# EAGLE design pdp (EAGLE 7.7.0)
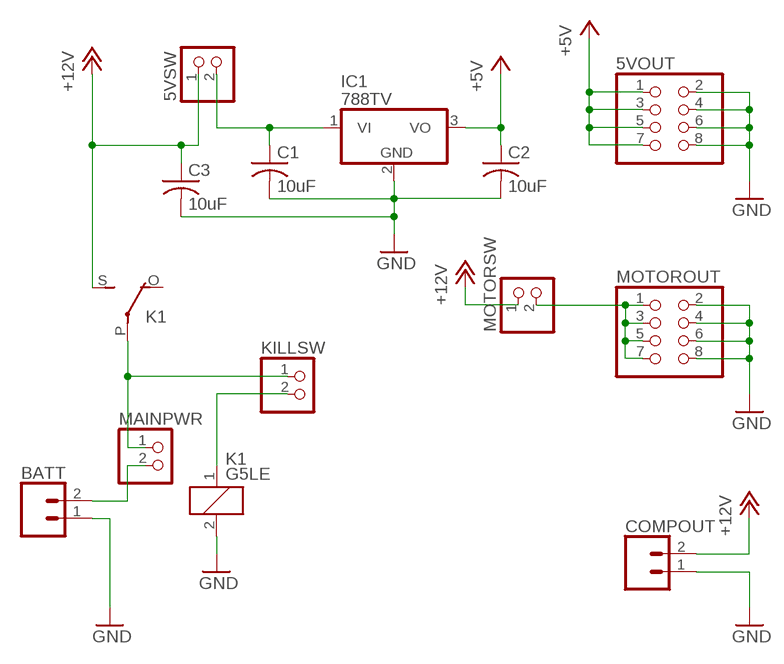
[diagram p0: schematic, sheet 1]

## Parts
5VOUT  PINHD-2X4  [2X04]
5VSW  PINHD-1X2  [1X02]
BATT  CONN_025MM  [SCREWTERMINAL-5MM-2]
C1  10uF  C-USC0805  [C0805]
C2  10uF  C-USC0805  [C0805]
C3  10uF  C-USC0805  [C0805]
COMPOUT  CONN_025MM  [SCREWTERMINAL-5MM-2]
IC1  788TV  [TO220V]
K1  G5LE  [G5LE]
KILLSW  PINHD-1X2  [1X02]
MAINPWR  PINHD-1X2  [1X02]
MOTOROUT  PINHD-2X4  [2X04]
MOTORSW  PINHD-1X2  [1X02]

## Nets
+5V: 5VOUT.1 5VOUT.3 5VOUT.5 5VOUT.7 C2.1 IC1.3(VO)
+12V: 5VSW.1 C3.1 COMPOUT.2 K1.S(2:S) MOTORSW.1
GND: 5VOUT.2 5VOUT.4 5VOUT.6 5VOUT.8 BATT.1 C1.2 C2.2 C3.2 COMPOUT.1 IC1.2(GND) K1.2 MOTOROUT.2 MOTOROUT.4 MOTOROUT.6 MOTOROUT.8
N$1: BATT.2 MAINPWR.2
N$2: K1.P(2:P) KILLSW.1 MAINPWR.1
N$3: K1.1 KILLSW.2
N$4: 5VSW.2 C1.1 IC1.1(VI)
N$5: MOTOROUT.1 MOTOROUT.3 MOTOROUT.5 MOTOROUT.7 MOTORSW.2
Unconnected: K1.O(2:O)

## Library data of the parts
5VOUT MOTOROUT = pinhead:PINHD-2X4: PIN HEADER
5VSW KILLSW MAINPWR MOTORSW = pinhead:PINHD-1X2: PIN HEADER
BATT COMPOUT = SparkFun-Connectors:CONN_02: Multi connection point. Often used as Generic Header-pin footprint for 0.1 inch spaced/style header connections On any of the 0.1 inch spaced packages, you can populate with these: Break Away Headers - Straight <https://www.sparkfun.com/products/116> (PRT-00116) Break Away Male Headers - Right Angle <https://www.sparkfun.com/products/553> (PRT-00553) Female Headers <https://www.sparkfun.com/products/115> (PRT-00115) Break Away Headers - Machine Pin <https://www.sparkfun.com/products/117> (PRT-00117) Break Away Female Headers - Swiss Machine Pin <https://www.sparkfun.com/products/743> (PRT-00743) For SCREWTERMINALS and SPRING TERMINALS visit here: Screw Terimnals on SparkFun.com <https://www.sparkfun.com/search/results?term=Screw+Terminals> (5mm/3.5mm/2.54mm spacing) This device is also useful as a general connection point to wire up your design to another part of your project. Our various solder wires solder well into these plated through hole pads. Hook-Up Wire - Assortment (Stranded, 22 AWG) <https://www.sparkfun.com/products/11375> (PRT-11375) Hook-Up Wire - Assortment (Solid Core, 22 AWG) <https://www.sparkfun.com/products/11367> (PRT-11367) View the entire wire category on our website here <https://www.sparkfun.com/categories/141> Special notes: Molex polarized connector foot print use with: PRT-08233 with associated crimp pins and housings. 2.54_SCREWTERM for use with PRT-10571. 3.5mm Screw Terminal footprints for PRT-08084 5mm Screw Terminal footprints for use with PRT-08432; SF_SKU: PRT-08432
C1-C3 = resistor:C-US: CAPACITOR, American symbol
IC1 = linear:78*: Positive VOLTAGE REGULATOR Source: http://cache.national.com/ds/LM/LM78L05.pdf http://www.fairchildsemi.com/ds/LM/LM7805.pdf
K1 = relay:G5LE: RELAY 1 x switch, 10 A/120 V AC, 8 A/30 V DC, Omron; OC_FARNELL: unknown; OC_NEWARK: unknown

## Board
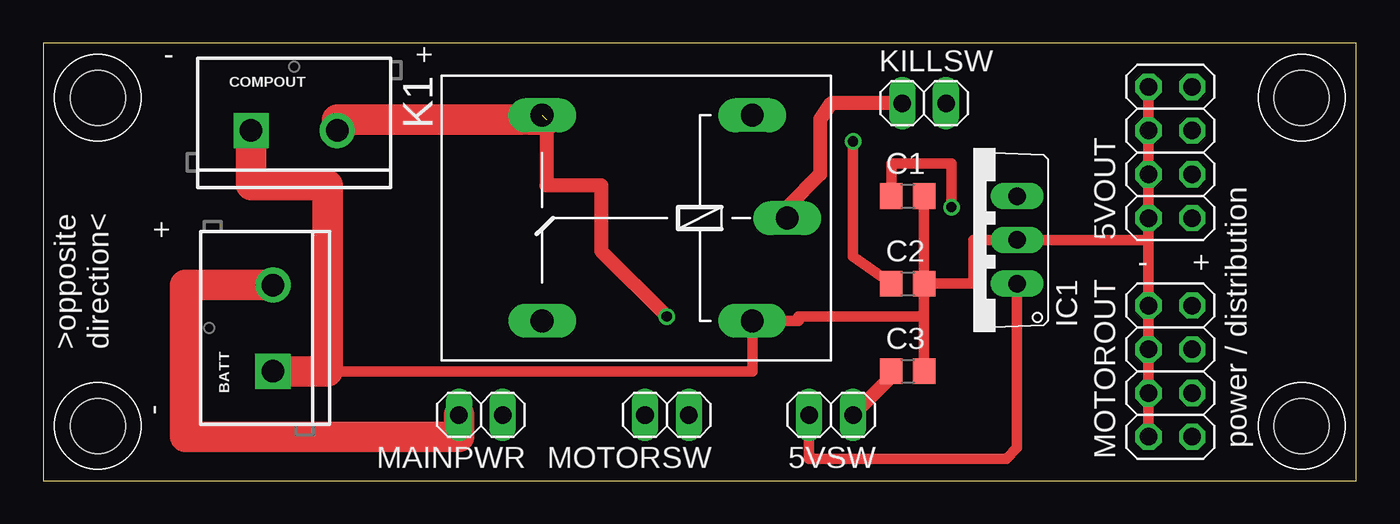
[diagram p1: board, top side]
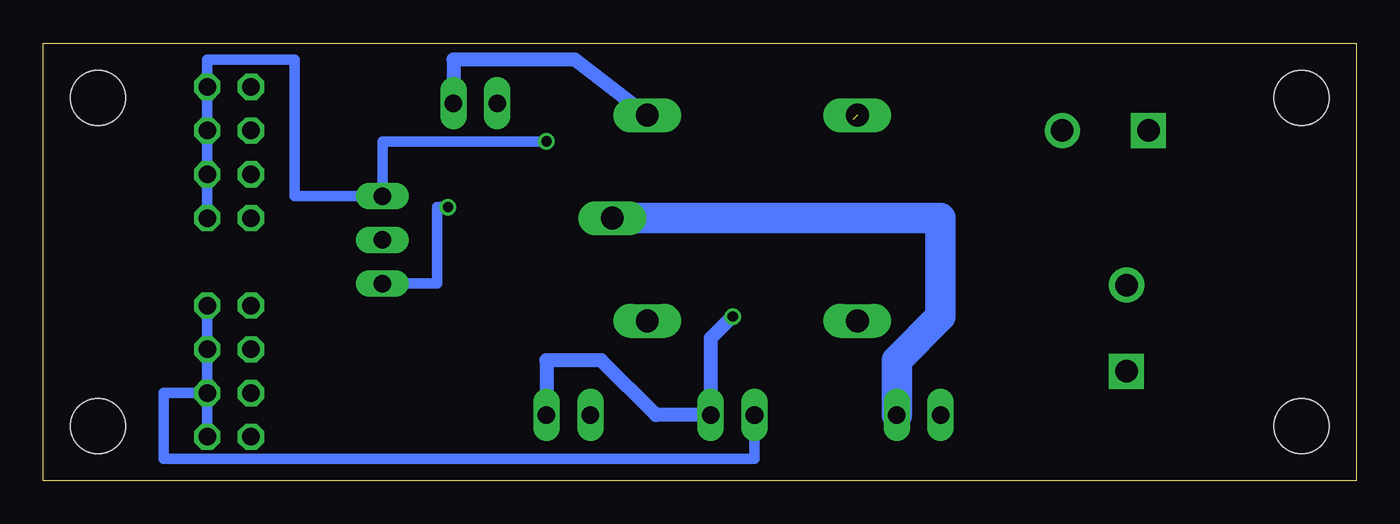
[diagram p2: board, bottom side, seen from below]

Size 76.2 x 25.4 mm. Coordinates in mm from the lower left corner, seen from the top.
Outline: 0,0 76.2,0 76.2,25.4 0,25.4 0,0
Copper layers (1*16): Top 0.0356mm / dielectric 1.5011mm / Bottom 0.0356mm
Design rules "LaenPCBOrder": minimum track width 6mil, minimum drill 13mil, track to track 6mil, track to pad 6mil, pad to pad 6mil, via to via 6mil, smd to smd 6mil, copper to edge 15mil, drill to drill 6mil, minimum pad ring 7mil, minimum via ring 7mil, stop-mask expansion 3mil, vias tented up to drill 0mil, thermal gap 10mil
Holes 3.17 mm at 3.17,22.23 3.17,3.17 73.03,3.17 73.03,22.23

### Footprints (pad centres in the part's own frame; a part is rotated, then mirrored left to right if it is on the bottom)
2X04 = drill 1.016 octagon: 1 -3.81,-1.27; 2 -3.81,1.27; 3 -1.27,-1.27; 4 -1.27,1.27; 5 1.27,-1.27; 6 1.27,1.27; 7 3.81,-1.27; 8 3.81,1.27
1X02 = drill 1.016 long: 1 -1.27,0; 2 1.27,0
SCREWTERMINAL-5MM-2 = drill 1.3 pad 2.032 square: 1 0,0 | drill 1.3 pad 2.032: 2 5,0
C0805 = smd 1.3 x 1.5: 1 -0.95,0; 2 0.95,0
TO220V = drill 1.016 long: 1 -2.54,-2.54; 2 0,-2.54; 3 2.54,-2.54
G5LE = drill 1.321 long: 1 -7.493,-5.969; 2 -7.493,5.969; O 4.699,5.969; P -9.525,0; S 4.699,-5.969

### Placement (x,y rotation side)
5VOUT  65.41,19.05 90 top
5VSW  45.72,3.81 180 top
BATT  13.34,6.35 90 top
C1  50.16,16.51 0 top
C2  50.16,11.43 0 top
C3  50.16,6.35 0 top
COMPOUT  12.06,20.32 0 top
IC1  53.98,13.97 90 top
K1  33.66,15.24 180 top
KILLSW  51.12,21.91 0 top
MAINPWR  25.4,3.81 180 top
MOTOROUT  65.41,6.35 90 top
MOTORSW  36.2,3.81 180 top

### Tracks (layer width: path | path; a pad name or v marks a point on that pad's centre or on a via)
+5V  (via drill 0.6)
  Top 0.61: C2.1 46.99,13.02 v46.99,19.68
  Bottom 0.61: 5VOUT.1 5VOUT.3 5VOUT.5 5VOUT.7 66.67,24.45 61.59,24.45 61.59,16.51 IC1.3 56.52,19.68 v46.99,19.68
+12V  (via drill 0.6)  (1 unrouted)
  Top 0.813: 29.21,20.95 29.21,17.14 32.38,17.14 32.38,13.34 v36.2,9.53 | 5VSW.1 49.22,6.04 C3.1
  Top 1.778: COMPOUT.2 17.07,20.95 29.21,20.95
  Bottom 0.813: v36.2,9.53 37.47,8.26 MOTORSW.1 40.64,3.81 43.81,6.99 46.99,6.99 5VSW.1
GND
  Top 0.61: 16.51,6.35 41.15,6.35 K1.2 43.81,9.27 43.81,9.53 51.12,9.53 | C3.2 51.12,9.53 | 51.12,9.53 C2.2 | C2.2 C1.2 | C2.2 53.98,11.43 53.98,13.97 IC1.2 64.14,13.97 5VOUT.2 | 5VOUT.8 5VOUT.6 5VOUT.4 5VOUT.2 | 5VOUT.2 MOTOROUT.8 MOTOROUT.6 MOTOROUT.4 MOTOROUT.2
  Top 1.778: BATT.1 16.51,6.35 16.51,17.14 12.06,17.14 COMPOUT.1
N$1
  Top 1.778: BATT.2 8.26,11.35 8.26,2.54 24.13,2.54 MAINPWR.2
N$2
  Top 0.813: KILLSW.1 45.72,21.91 45.09,20.95 45.09,17.78 43.18,15.88 K1.P
  Bottom 1.778: MAINPWR.1 26.67,6.99 24.13,9.53 24.13,15.24 K1.P
N$3
  Bottom 0.813: K1.1 45.34,24.45 52.39,24.45 KILLSW.2
N$4  (via drill 0.6)
  Top 0.61: 5VSW.2 44.45,1.27 55.88,1.27 56.52,1.91 IC1.1 | C1.1 49.22,18.41 52.7,18.41 v52.7,15.88
  Bottom 0.61: v52.7,15.88 53.34,15.88 53.34,11.43 IC1.1
N$5
  Bottom 0.61: MOTOROUT.7 MOTOROUT.5 MOTOROUT.3 | MOTOROUT.3 MOTOROUT.1 | MOTOROUT.3 69.22,5.08 69.22,1.27 34.92,1.27 MOTORSW.2

### Text on the board
tPlace: - | + | + | - | + | >opposite / direction< | - | power / distribution